# Altium schematic sheet PowerDevices.SchDoc
size A4
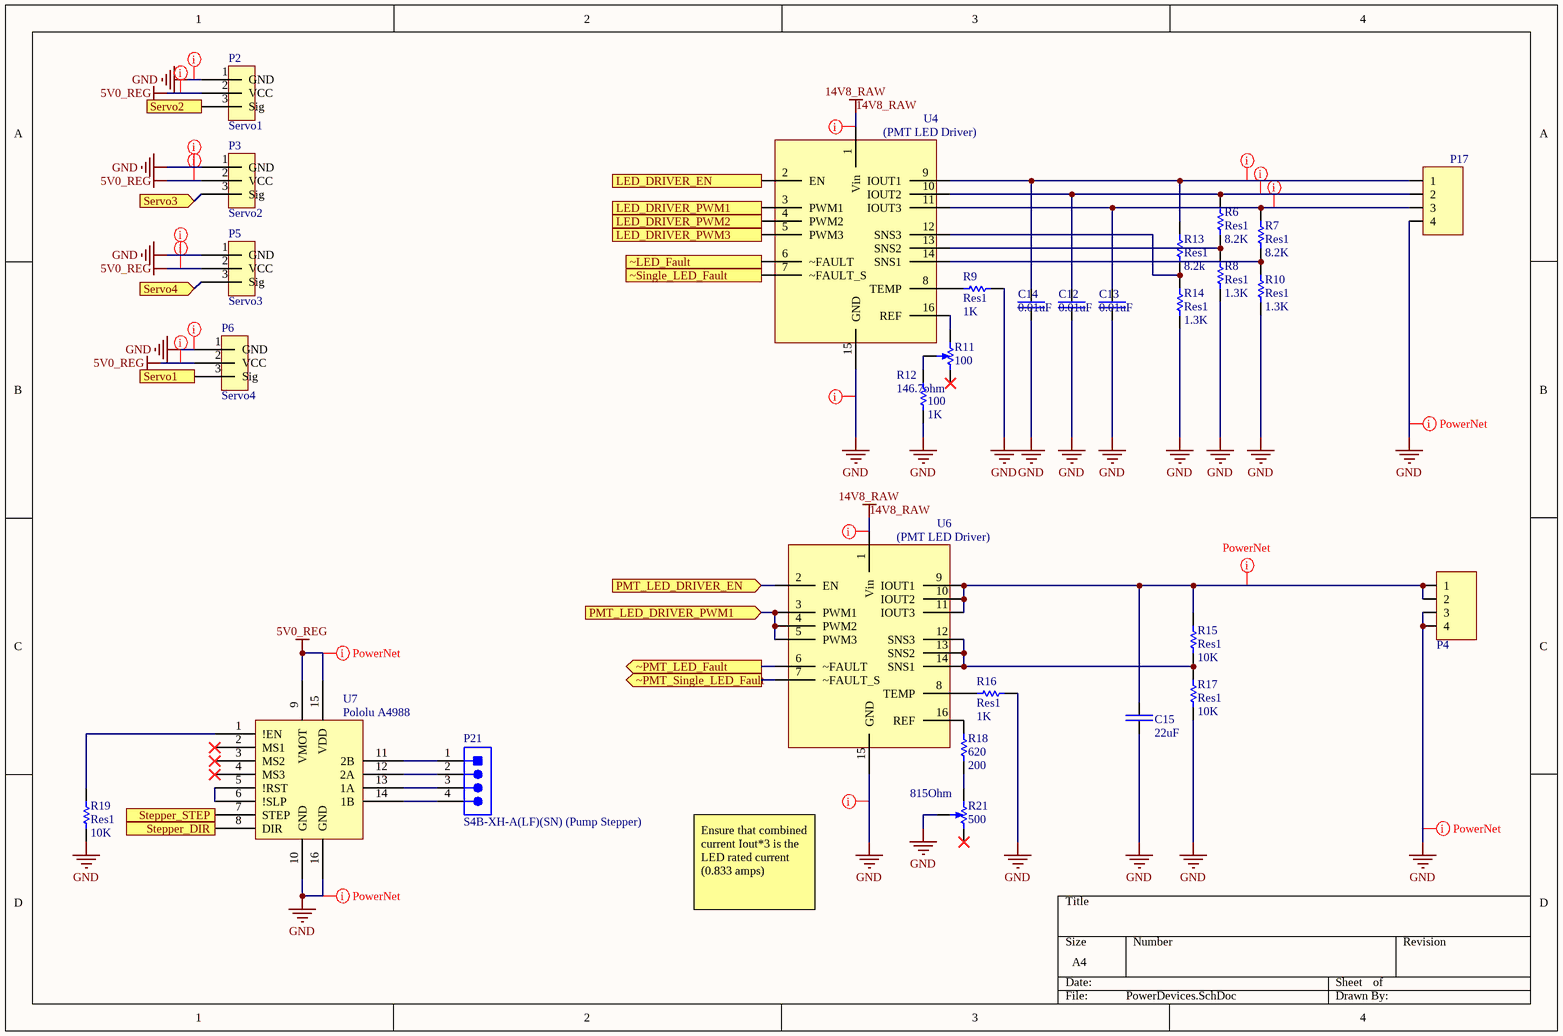
[diagram p0: PowerDevices.SchDoc]

## Parts
C12  0.01uF  [0.01uF capacitor]
C13  0.01uF  [0.01uF capacitor]
C14  0.01uF  [0.01uF capacitor]
C15  22uF  [22uF Capacitor]
P2  Servo1  [Header3]
P3  Servo2  [Header3]
P4  Mini-Fit Jr 4 Pos  [MOLEX 0039281043]  (value not drawn)
P5  Servo3  [Header3]
P6  Servo4  [Header3]
P17  Mini-Fit Jr 4 Pos  [MOLEX 0039281043]  (value not drawn)
P21  S4B-XH-A(LF)(SN) (Pump Stepper)  [JST-S4B-XH-A(LF)(SN)_V]
R6  Res1  value 8.2K  [RESC1608X06N_0603]
R7  Res1  value 8.2K  [RESC1608X06N_0603]
R8  Res1  value 1.3K  [RESC1608X06N_0603]
R9  Res1  value 1K  [RESC1608X06N_0603]
R10  Res1  value 1.3K  [RESC1608X06N_0603]
R11  100  [POT-LV10]
R12  100  value 1K  [RESC1608X06N_0603]
R13  Res1  value 8.2k  [RESC1608X06N_0603]
R14  Res1  value 1.3K  [RESC1608X06N_0603]
R15  Res1  value 10K  [RESC1608X06N_0603]
R16  Res1  value 1K  [RESC1608X06N_0603]
R17  Res1  value 10K  [RESC1608X06N_0603]
R18  620  value 200  [RESC1608X06N_0603]
R19  Res1  value 10K  [RESC1608X06N_0603]
R21  500  [POT-LV10]
U4  (PMT LED Driver)  [HTSSOP16]
U6  (PMT LED Driver)  [HTSSOP16]
U7  Pololu A4988  [Stepper Driver Pololu A4988]

## Ports
LED_DRIVER_EN (in), LED_DRIVER_PWM1 (in), LED_DRIVER_PWM2 (in), LED_DRIVER_PWM3 (in), PMT_LED_DRIVER_EN (in), PMT_LED_DRIVER_PWM1 (in), Servo1 (in), Servo2 (in), Servo3 (in), Servo4 (in), Stepper_DIR (in), Stepper_STEP (in), ~LED_Fault (out), ~PMT_LED_Fault (out), ~PMT_Single_LED_Fault (out), ~Single_LED_Fault (out)

## Nets
5V0_REG: P2.2(VCC) P3.2(VCC) P5.2(VCC) P6.2(VCC) U7.9(VMOT) U7.15(VDD)
14V8_RAW: U4.1(Vin) U6.1(Vin)
GND: C12.1 C13.1 C14.1 C15.1 P2.1(GND) P3.1(GND) P4.3 P4.4 P5.1(GND) P6.1(GND) P17.4 R8.1 R9.2 R10.1 R12.2 R14.1 R16.2 R17.1 R19.1 R21.W U4.15(GND) U6.15(GND) U7.10(GND) U7.16(GND)
LED_DRIVER_EN: U4.2(EN) ; port LED_DRIVER_EN
LED_DRIVER_PWM1: U4.3(PWM1) ; port LED_DRIVER_PWM1
LED_DRIVER_PWM2: U4.4(PWM2) ; port LED_DRIVER_PWM2
LED_DRIVER_PWM3: U4.5(PWM3) ; port LED_DRIVER_PWM3
PMT_LED_DRIVER_EN: U6.2(EN) ; port PMT_LED_DRIVER_EN
PMT_LED_DRIVER_PWM1: U6.3(PWM1) U6.4(PWM2) U6.5(PWM3) ; port PMT_LED_DRIVER_PWM1
Servo1: P6.3(Sig) ; port Servo1
Servo2: P2.3(Sig) ; port Servo2
Servo3: P3.3(Sig) ; port Servo3
Servo4: P5.3(Sig) ; port Servo4
Stepper_DIR: U7.8(DIR) ; port Stepper_DIR
Stepper_STEP: U7.7(STEP) ; port Stepper_STEP
~LED_Fault: U4.6(~FAULT) ; port ~LED_Fault
~PMT_LED_Fault: U6.6(~FAULT) ; port ~PMT_LED_Fault
~PMT_Single_LED_Fault: U6.7(~FAULT_S) ; port ~PMT_Single_LED_Fault
~Single_LED_Fault: U4.7(~FAULT_S) ; port ~Single_LED_Fault
NetC12_2: C12.2 P17.2 R6.2 U4.10(IOUT2)
NetC13_2: C13.2 P17.3 R7.2 U4.11(IOUT3)
NetC14_2: C14.2 P17.1 R13.1 U4.9(IOUT1)
NetC15_2: C15.2 P4.1 P4.2 R15.1 U6.9(IOUT1) U6.10(IOUT2) U6.11(IOUT3)
NetP21_1: P21.1 U7.11(2B)
NetP21_2: P21.2 U7.12(2A)
NetP21_3: P21.3 U7.13(1A)
NetP21_4: P21.4 U7.14(1B)
NetR6_1: R6.1 R8.2 U4.13(SNS2)
NetR7_1: R7.1 R10.2 U4.14(SNS1)
NetR9_1: R9.1 U4.8(TEMP)
NetR11_CCW: R11.CCW(-) U4.16(REF)
NetR11_W: R11.W R12.1
NetR13_2: R13.2 R14.2 U4.12(SNS3)
NetR15_2: R15.2 R17.2 U6.12(SNS3) U6.13(SNS2) U6.14(SNS1)
NetR16_1: R16.1 U6.8(TEMP)
NetR18_1: R18.1 R21.CCW(-)
NetR18_2: R18.2 U6.16(REF)
NetR19_2: R19.2 U7.1(!EN)
NetU7_5: U7.5(!RST) U7.6(!SLP)

Not connected (* = marked no-connect by the designer): R11 CW(+)*; R21 CW(+)*; U7 2(MS1)* 3(MS2)* 4(MS3)*

## Layout directives
rule Width Constraint [Pref Width = 15mil    Min Width = 15mil    Max Width = 15mil]: 5V0_REG, 14V8_RAW, GND, NetC12_2, NetC13_2, NetC14_2
net class PowerNet: GND, NetC15_2
mark named PowerNet: 5V0_REG, GND

## Notes on the sheet
- (near R12) 146.7ohm
- (near R21) 815Ohm
- Ensure that combined current Iout*3 is the LED rated current (0.833 amps)

## Library data of the parts
C12-C14 = C0603C103KARACAUTO: Cap Ceramic 0.01uF 250V X7R 10% Pad SMD 0603 125C Automotive T/R; Manufacturer 1: KEMET; Capacitance: 10nF; Supplier 1: Digi-Key; Supplier Part Number 1: 399-17960-1-ND; Manufacturer Part Number 1: C0603C103KARACAUTO; Stock 1: 8483; Pricing 1: 1=0,90000, 10=0,68500, 100=0,49040, 500=0,37964, 1000=0,32691 (USD); RoHS: No; Mount: Surface Mount; Case/Package: 0603; Case Code (Imperial): 0603; Case Code (Metric): 1608; Min Operating Temperature: -55°C; Max Operating Temperature: 125°C; Packaging: Tape and Reel; Tolerance: 10%; Voltage Rating: 250V; Ratings: AEC-Q200; ComponentLink1URL: https://api.kemet.com/component-edge/download/datasheet/C0603C103KARACAUTO.pdf?src-supplier=Digi-Key; ComponentLink1Description: https://api.kemet.com/component-edge/download/datasheet/C0603C103KARACAUTO.pdf?src-supplier=Digi-Key; Category: Capacitor
C15 = GRM32ER71E226KE15L: Cap Ceramic 22uF 25V X7R 10% SMD 1210 125C Embossed T/R; Manufacturer 1: Murata; Supplier 1: Digi-Key; Supplier Part Number 1: 490-5313-6-ND; Manufacturer Part Number 1: GRM32ER71E226KE15L; Stock 1: 52660; Pricing 1: 1=1,78000, 10=1,40600, 100=1,05410, 500=0,79646 (USD); RoHS: Yes; Mount: Surface Mount; Case/Package: 1210; Number of Pins: 2; Case Code (Metric): 3225; Case Code (Imperial): 1210; Material: Ceramic; Min Operating Temperature: -55°C; Max Operating Temperature: 125°C; Capacitance: 22uF; Tolerance: 10%; Dielectric: X7R; Voltage Rating: 25V; Packaging: Tape and Reel; Package Quantity: 1; Voltage Rating (DC): 25V; Termination: SMD/SMT; Voltage: 25V; Length: 3.2mm; Height: 2.5mm; Width: 0.098inch; Thickness: 0.106inch; Depth: 2.5mm; Radiation Hardening: No; REACH SVHC: No SVHC; Lead Free: Lead Free; ComponentLink1URL: https://datasheet.ciiva.com/6072/1697714-6072768.pdf?src-supplier=Farnell; ComponentLink1Description: https://datasheet.ciiva.com/6072/1697714-6072768.pdf?src-supplier=Farnell; ComponentLink2URL: https://datasheet.ciiva.com/16497/product-16497009.pdf?src-supplier=Future+Electronics; ComponentLink2Description: https://datasheet.ciiva.com/16497/product-16497009.pdf?src-supplier=Future+Electronics; ComponentLink3URL: https://datasheet.ciiva.com/3776/2741grm32er71e226ke1523-3776996.pdf?src-supplier=Arrow; ComponentLink3Description: https://datasheet.ciiva.com/3776/2741grm32er71e226ke1523-3776996.pdf?src-supplier=Arrow; ComponentLink4URL: https://datasheet.ciiva.com/11789/0900766b80ef921d-11789129.pdf?src-supplier=RSComponents; ComponentLink4Description: https://datasheet.ciiva.com/11789/0900766b80ef921d-11789129.pdf?src-supplier=RSComponents; ComponentLink5URL: https://datasheet.ciiva.com/29201/451826-da-01-de-vs-kondens-grm32-er71e-226ke15l-29201795.pdf?src-supplier=Conrad; ComponentLink5Description: https://datasheet.ciiva.com/29201/451826-da-01-de-vs-kondens-grm32-er71e-226ke15l-29201795.pdf?src-supplier=Conrad; ComponentLink6URL: https://datasheet.ciiva.com/175/partnumbering-e-01-175746.pdf?src-supplier=Digi-Key; ComponentLink6Description: https://datasheet.ciiva.com/175/partnumbering-e-01-175746.pdf?src-supplier=Digi-Key; ComponentLink7URL: https://datasheet.ciiva.com/175/partnumbering-e-01-175747.pdf?src-supplier=Digi-Key; ComponentLink7Description: https://datasheet.ciiva.com/175/partnumbering-e-01-175747.pdf?src-supplier=Digi-Key; ComponentLink8URL: https://datasheet.ciiva.com/175/partnumbering-e-01-175748.pdf?src-supplier=Digi-Key; ComponentLink8Description: https://datasheet.ciiva.com/175/partnumbering-e-01-175748.pdf?src-supplier=Digi-Key; ComponentLink9URL: https://datasheet.ciiva.com/22703/1697714-22703397.pdf?src-supplier=Element14; ComponentLink9Description: https://datasheet.ciiva.com/22703/1697714-22703397.pdf?src-supplier=Element14; Category: Capacitor
P2 P3 P5 P6 = Header3
P4 P17 = Molex 0039281043: Mini-Fit Jr. Header, Dual Row, Right-Angle, with Snap-in Plastic Peg PCB Lock, 6 Circuits, PA Polyamide Nylon 6/6 94V-2, 0.76µm Select Gold (Au) Plating
P21 = CMP-1755-00007-1: Male Header, Pitch 2.5 mm, 1 x 4 Position, Height 6.1 mm, Tail Length 3.4 mm, -25 to 85 degC, RoHS, Bulk; PackageReference: S4B-XH-A(LF)(SN); ComponentLink1Description: Manufacturer URL; DatasheetVersion: May-16; ComponentLink2Description: Datasheet; ComponentLink2URL: http://www.jst-mfg.com/product/pdf/eng/eXH.pdf; ComponentLink1URL: http://www.jst.com/home2.html; PackageDescription: Male Header, Pitch 2.5 mm, 1 x 4 Position, Height 6.1 mm, Tail Length 3.4 mm
R6-R10 R12-R19 = Res1: Resistor; Published: 8-Jun-2000; LatestRevisionDate: 17-Jul-2002; LatestRevisionNote: Re-released for DXP Platform.; PackageReference: AXIAL-0.3; Publisher: Altium Limited; PackageDescription: Axial Device, Thru-Hole; 2 Leads; 0.3 in Pin Spacing
R11 R21 = RPot SM: Square Trimming Potentiometer (100 ohm); Published: 17-Dec-2003; DatasheetVersion: Oct-2003; PackageReference: POT4MM-2; Publisher: Altium Limited; PackageDescription: Square Trimming Potentiometer; ComponentLink1Description: Manufacturer Link; ComponentLink1URL: http://bourns.com/2/search.html
U4 U6 = TPS92630QPWPRQ1
U7 = stepper driver Pololu a4988